# EAGLE design AR0130_DEV_BOARD_BREAKOUT_V2 (EAGLE 9.0.0)
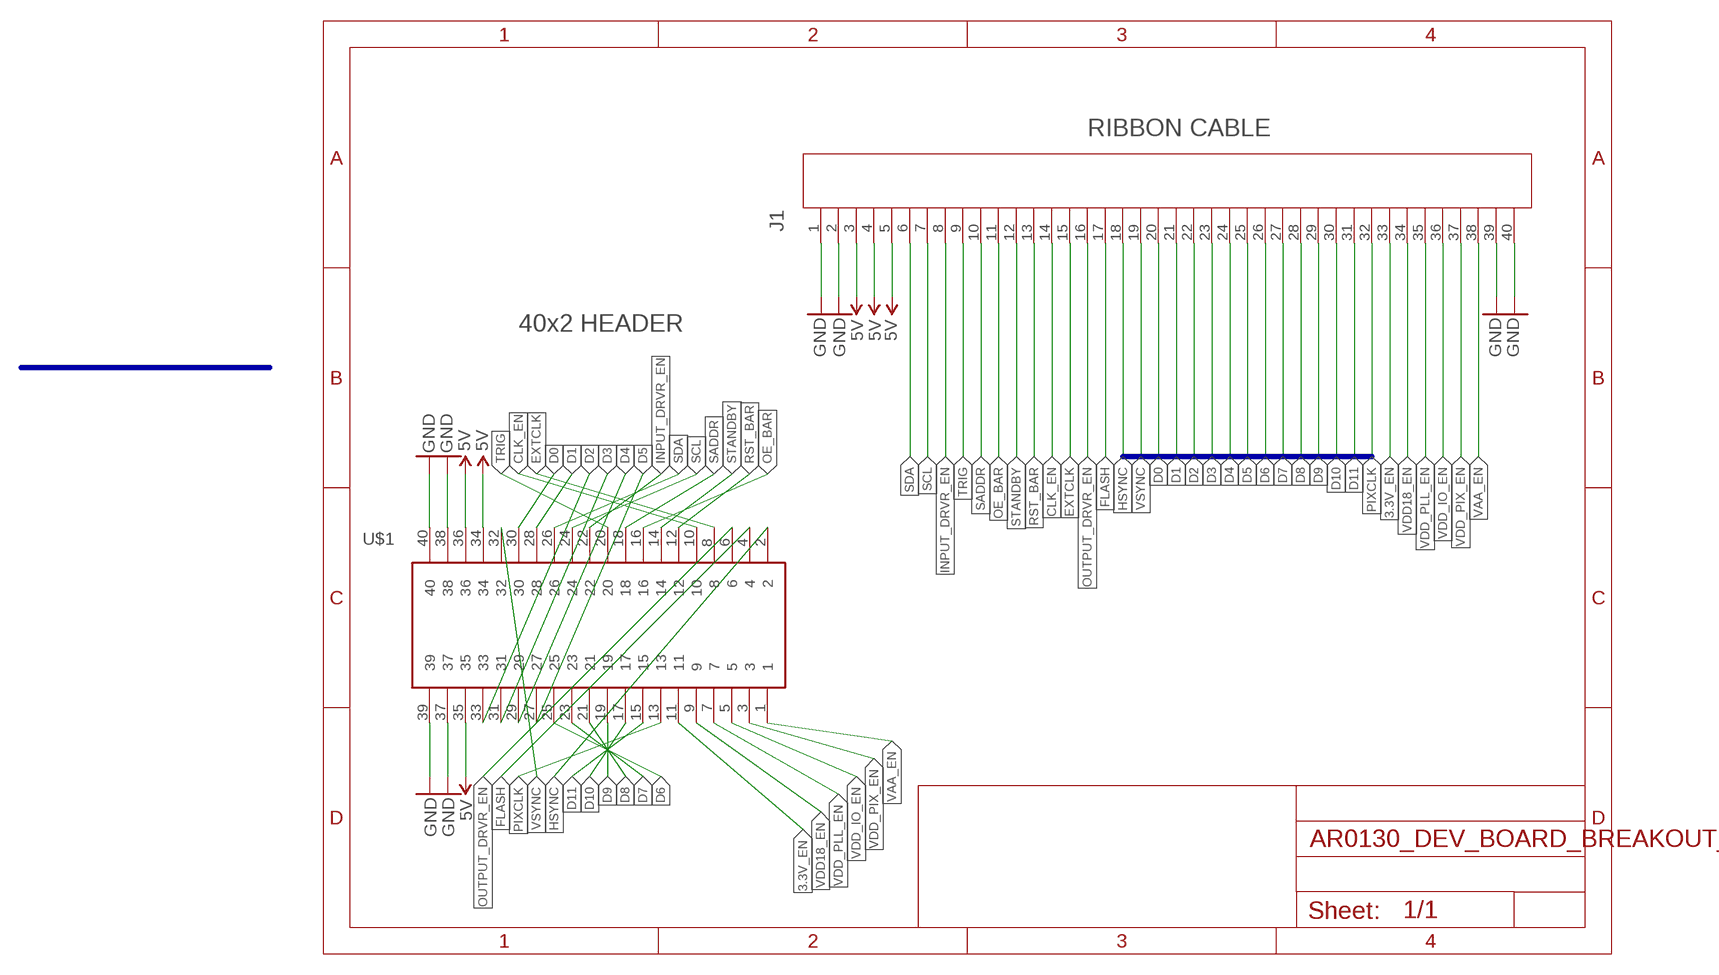
[diagram p0: schematic, sheet 1]

## Parts
J1  4-1734592-0  [CONN_4-1734592-0_TYCO]
U$1  HTSW-120-XX-XXX-D  [CON40_2X20_TU_TSW]

## Nets
3.3V_EN: J1.33 U$1.11
5V: J1.3 J1.4 J1.5 U$1.34 U$1.35 U$1.36
CLK_EN: J1.14 U$1.10
D0: J1.20 U$1.30
D1: J1.21 U$1.28
D2: J1.22 U$1.33
D3: J1.23 U$1.31
D4: J1.24 U$1.29
D5: J1.25 U$1.27
D6: J1.26 U$1.25
D7: J1.27 U$1.23
D8: J1.28 U$1.21
D9: J1.29 U$1.19
D10: J1.30 U$1.17
D11: J1.31 U$1.15
EXTCLK: J1.15 U$1.8
FLASH: J1.17 U$1.4
GND: J1.1 J1.2 J1.39 J1.40 U$1.37 U$1.38 U$1.39 U$1.40
HSYNC: J1.18 U$1.2
INPUT_DRVR_EN: J1.8 U$1.22
OE_BAR: J1.11 U$1.16
OUTPUT_DRVR_EN: J1.16 U$1.6
PIXCLK: J1.32 U$1.13
RST_BAR: J1.13 U$1.12
SADDR: J1.10 U$1.18
SCL: J1.7 U$1.24
SDA: J1.6 U$1.26
STANDBY: J1.12 U$1.14
TRIG: J1.9 U$1.20
VAA_EN: J1.38 U$1.1
VDD18_EN: J1.34 U$1.9
VDD_IO_EN: J1.36 U$1.5
VDD_PIX_EN: J1.37 U$1.3
VDD_PLL_EN: J1.35 U$1.7
VSYNC: J1.19 U$1.32

## Buses
D[0..11],HSYNC,VSYNC,PIXCLK

## Notes on the sheet
- RIBBON CABLE
- 40x2 HEADER

## Library data of the parts
J1 = Oliver_Custom:4-1734592-0; MANUFACTURER_PART_NUMBER: 417345920; VENDOR: TE Connectivity
U$1 = Oliver_Custom:HTSW-120-XX-XXX-D

## Board
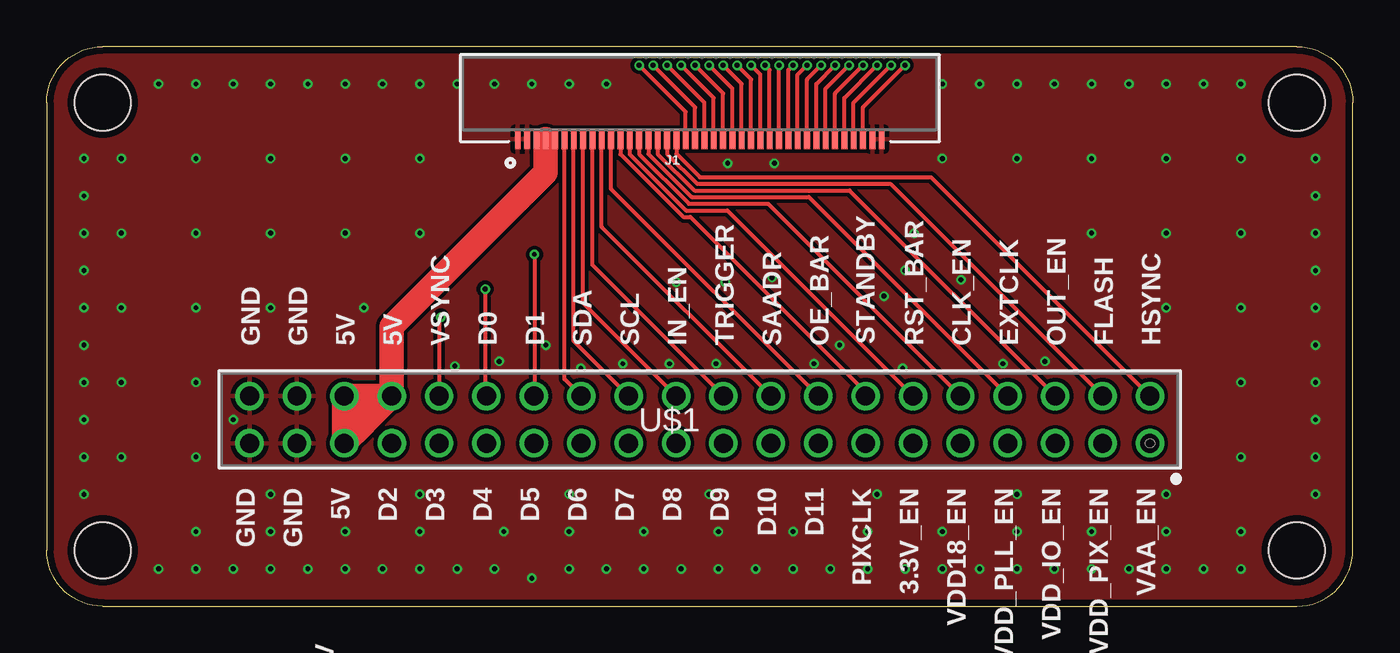
[diagram p1: board, top side]
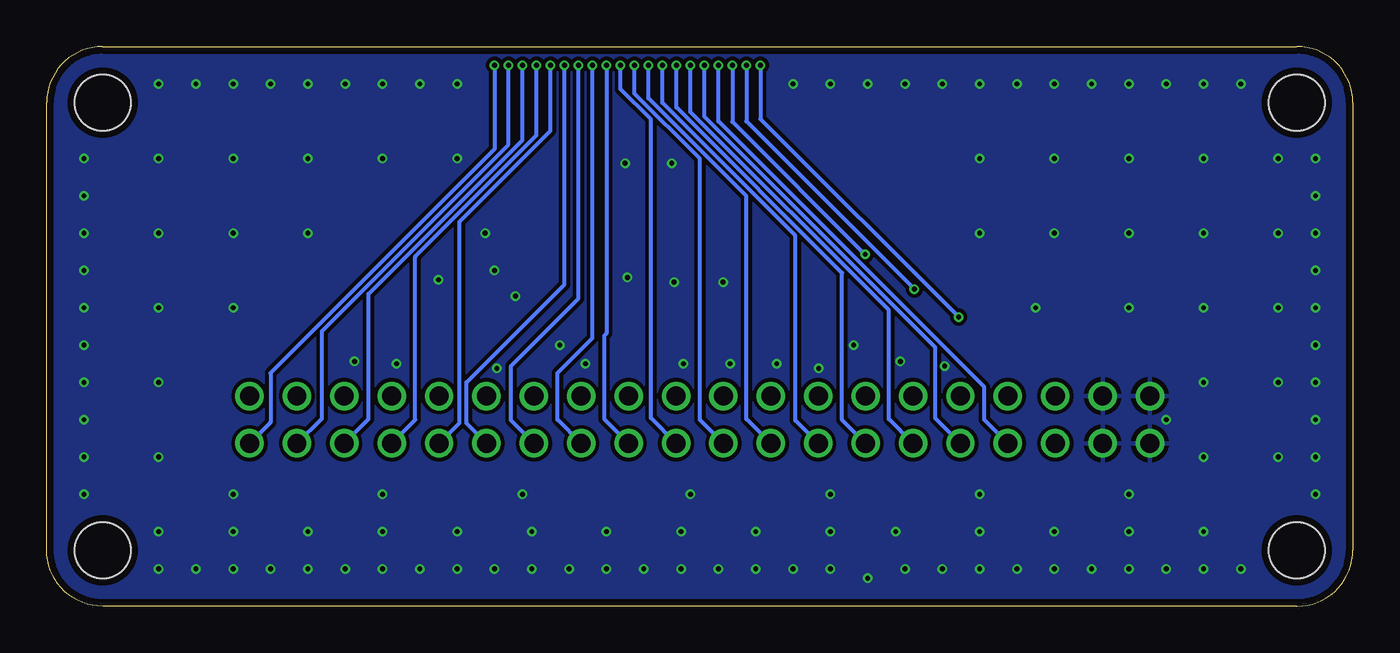
[diagram p2: board, bottom side, seen from below]

Size 70 x 30 mm. Coordinates in mm from the lower left corner, seen from the top.
Outline: 3,0 67,0 arc90 70,3 70,27 arc90 67,30 3,30 arc90 0,27 0,3 arc90 3,0
Copper layers (1*16): Top 0.035559375mm / dielectric 1.6mm / Bottom 0.035559375mm
Design rules "oshpark-2layer-tented": minimum track width 6mil, minimum drill 10mil, track to track 6mil, track to pad 6mil, pad to pad 6mil, via to via 6mil, smd to smd 6mil, copper to edge 15mil, drill to drill 6mil, minimum pad ring 5mil, minimum via ring 5mil, stop-mask expansion 2.5mil, vias tented up to drill 20mil, thermal gap 10mil
Holes 3 mm at 3,3 67,3 3,27 67,27

### Footprints (pad centres in the part's own frame; a part is rotated, then mirrored left to right if it is on the bottom)
CONN_4-1734592-0_TYCO = smd 0.305 x 1.092: 1 -9.751,0; 2 -9.251,0; 3 -8.751,0; 4 -8.251,0; 5 -7.75,0; 6 -7.25,0; 7 -6.75,0; 8 -6.25,0; 9 -5.751,0; 10 -5.25,0; 11 -4.75,0; 12 -4.25,0; 13 -3.751,0; 14 -3.251,0; 15 -2.751,0; 16 -2.251,0; 17 -1.75,0; 18 -1.25,0; 19 -0.751,0; 20 -0.251,0; 21 0.249,0; 22 0.75,0; 23 1.25,0; 24 1.749,0; 25 2.249,0; 26 2.749,0; 27 3.249,0; 28 3.749,0; 29 4.249,0; 30 4.75,0; 31 5.25,0; 32 5.749,0; 33 6.25,0; 34 6.749,0; 35 7.25,0; 36 7.75,0; 37 8.249,0; 38 8.749,0; 39 9.249,0; 40 9.749,0
CON40_2X20_TU_TSW = drill 1.016 pad 1.524: 1 24.13,-1.27; 2 24.13,1.27; 3 21.59,-1.27; 4 21.59,1.27; 5 19.05,-1.27; 6 19.05,1.27; 7 16.51,-1.27; 8 16.51,1.27; 9 13.97,-1.27; 10 13.97,1.27; 11 11.43,-1.27; 12 11.43,1.27; 13 8.89,-1.27; 14 8.89,1.27; 15 6.35,-1.27; 16 6.35,1.27; 17 3.81,-1.27; 18 3.81,1.27; 19 1.27,-1.27; 20 1.27,1.27; 21 -1.27,-1.27; 22 -1.27,1.27; 23 -3.81,-1.27; 24 -3.81,1.27; 25 -6.35,-1.27; 26 -6.35,1.27; 27 -8.89,-1.27; 28 -8.89,1.27; 29 -11.43,-1.27; 30 -11.43,1.27; 31 -13.97,-1.27; 32 -13.97,1.27; 33 -16.51,-1.27; 34 -16.51,1.27; 35 -19.05,-1.27; 36 -19.05,1.27; 37 -21.59,-1.27; 38 -21.59,1.27; 39 -24.13,-1.27; 40 -24.13,1.27

### Placement (x,y rotation side)
J1  35,25.04 0 top
U$1  35,10 0 top

### Tracks (layer width: path | path; a pad name or v marks a point on that pad's centre or on a via)
3.3V_EN  (via drill 0.25)
  Top 0.203: J1.33 41.25,28 v42.25,29
  Bottom 0.203: U$1.11 47.5,9.8 47.5,12 42.25,17.25 v42.25,29
5V
  Top 0.254: J1.3 J1.4 J1.5
  Top 1.3: U$1.35 U$1.36 17,11.27 | 17,11.27 U$1.34 | U$1.34 18.49,14.99 26.75,23.25 J1.4 | U$1.35 U$1.34 | U$1.35 17,9.78 17,11.27
CLK_EN
  Top 0.203: J1.14 31.75,24.24 34.41,21.58 38.66,21.58 U$1.10
D0  (via drill 0.25)
  Top 0.203: J1.20 34.75,26.75 v32.5,29 | v23.5,17 23.5,11.34 U$1.30
  Bottom 0.203: v32.5,29 32.5,26 v23.5,17
D1  (via drill 0.25)
  Top 0.203: J1.21 35.25,27 v33.25,29 | v26.14,18.86 26.14,11.3 U$1.28
  Bottom 0.203: v33.25,29 33.25,25.97 v26.14,18.86
D2  (via drill 0.25)
  Top 0.203: J1.22 35.75,27.25 v34,29
  Bottom 0.203: U$1.33 19.75,9.99 19.75,11.75 34,26 v34,29
D3  (via drill 0.25)
  Top 0.203: J1.23 36.25,27.5 v34.75,29
  Bottom 0.203: U$1.31 22.38,10.07 22.38,13.87 34.75,26.25 v34.75,29
D4  (via drill 0.25)
  Top 0.203: J1.24 36.75,27.75 v35.5,29
  Bottom 0.203: U$1.29 24.88,10.04 24.88,15.87 35.5,26.49 v35.5,29
D5  (via drill 0.25)
  Top 0.203: J1.25 37.25,28 v36.25,29
  Bottom 0.203: U$1.27 27.38,9.99 27.38,17.87 36.25,26.74 v36.25,29
D6  (via drill 0.25)
  Top 0.203: J1.26 37.75,28.25 v37,29
  Bottom 0.203: U$1.25 29.88,9.96 29.88,19.86 37,26.99 v37,29
D7  (via drill 0.25)
  Top 0.203: J1.27 38.25,28.5 v37.75,29
  Bottom 0.203: U$1.23 32.5,10.04 32.5,21.98 37.75,27.23 v37.75,29
D8  (via drill 0.25)
  Top 0.203: J1.28 38.75,28.75 v38.5,29
  Bottom 0.203: U$1.21 35,10 35,23.98 38.5,27.48 v38.5,29
D9  (via drill 0.25)
  Top 0.152: v39.25,29
  Top 0.203: J1.29 v39.25,29
  Bottom 0.203: U$1.19 37.62,10.09 37.62,26.11 39.25,27.73 v39.25,29
D10  (via drill 0.25)
  Top 0.203: J1.30 39.75,28.75 v40,29
  Bottom 0.203: U$1.17 40.12,10.04 40.12,14.5 40,14.62 v40,29
D11  (via drill 0.25)
  Top 0.203: J1.31 40.25,28.5 v40.75,29
  Bottom 0.203: U$1.15 42.62,10.01 42.62,12.5 40.75,14.38 v40.75,29
EXTCLK
  Top 0.203: U$1.8 40.85,21.93 34.56,21.93 32.25,24.24 J1.15
FLASH
  Top 0.203: U$1.4 45.22,22.64 34.85,22.64 33.25,24.25 J1.17
GND  (via drill 0.25)
  other vias: 10,10 6,2 8,2 10,2 12,2 14,2 16,2 18,2 20,2 22,2 24,2 26,1.5 28,2 30,2 32,2 34,2 36,2 38,2 40,2 42,2 44,2 46,2 48,2 50,2 52,2 54,2 56,2 58,2 60,2 62,2 64,2 68,6 68,8 68,10 68,12 68,14 68,16 68,18 68,20 68,22 2,6 2,8 2,10 2,12 2,14 2,16 2,18 2,20 2,22 2,24 6,28 8,28 10,28 12,28 14,28 16,28 18,28 20,28 22,28 24,28 26,28 28,28 30,28 48,28 50,28 52,28 54,28 56,28 58,28 60,28 62,28 64,28 8,24 12,24 16,24 20,24 20,20 16,20 12,20 8,20 8,16 12,16 17,16 4,16 4,20 4,24 4,12 8,12 8,8 4,8 8,4 12,4 16,4 20,4 24.5,4 28,4 32,4 36,4 40,4 44,4 48,4 52,4 56,4 60,4 64,4 64,8 64,12 64,16 60,16 60,20 64,20 64,24 60,24 68,24 56,24 56,20 52,24 48,24 12,6 20,6 28,6 35.5,6 44.5,6 52,6 60,6 46,18 46.5,20 49,17.5 33.75,17.38 36.38,17.38 39,23.75 36.5,23.75 44.88,16.62 42.5,14 41.12,13 45.88,12.75 35.88,13 33.38,13 38.88,17.62 51.25,13 53.5,13.12 30.88,13 28.62,12.75 26.75,14 24.25,13.12 21.88,12.88
  pour Top (isolate 0.2): 0,0 70,0 70,25.75 70,30 44.5,30 0,30
  pour Bottom (isolate 0.2): 0,0 70,0 70,25.75 70,30 44.5,30 0,30
HSYNC
  Top 0.203: J1.18 33.75,24.25 35,23 47.4,23 U$1.2
INPUT_DRVR_EN
  Top 0.203: U$1.22 28.75,16.25 J1.8
OE_BAR
  Top 0.203: U$1.16 30.25,22.37 J1.11
OUTPUT_DRVR_EN
  Top 0.203: U$1.6 43.03,22.29 34.7,22.29 32.75,24.25 J1.16
PIXCLK  (via drill 0.25)
  Top 0.203: J1.32 40.75,28.25 v41.5,29
  Bottom 0.203: U$1.13 45.12,9.96 45.12,12.88 41.5,16.5 v41.5,29
RST_BAR
  Top 0.203: J1.13 31.25,24.24 34.26,21.22 36.48,21.22 U$1.12
SADDR
  Top 0.203: U$1.18 29.75,20.33 J1.10
SCL
  Top 0.203: U$1.24 28.25,14.21 J1.7
SDA
  Top 0.203: U$1.26 27.75,12.17 J1.6
STANDBY
  Top 0.203: J1.12 30.75,24.23 34.12,20.87 34.5,20.87 43.89,11.48 U$1.14
TRIG
  Top 0.203: U$1.20 29.25,18.29 J1.9
VAA_EN  (via drill 0.25)
  Top 0.203: J1.38 43.75,26.75 v46,29
  Bottom 0.203: v46,29 46,24.5 58,12.5 58,9.86 U$1.1
VDD18_EN  (via drill 0.25)
  Top 0.203: J1.34 41.75,27.75 v43,29
  Bottom 0.203: v43,29 43,25.49 47.88,20.61 47.88,9.82 U$1.9
VDD_IO_EN  (via drill 0.25)
  Top 0.203: J1.36 42.75,27.25 v44.5,29
  Bottom 0.203: U$1.5 52.75,10.03 52.75,16.74 44.5,24.99 v44.5,29
VDD_PIX_EN  (via drill 0.25)
  Top 0.203: J1.37 43.25,27 v45.25,29
  Bottom 0.203: U$1.3 55.25,10.07 55.25,14.75 45.25,24.75 v45.25,29
VDD_PLL_EN  (via drill 0.25)
  Top 0.203: J1.35 42.25,27.5 v43.75,29
  Bottom 0.203: U$1.7 50.25,9.99 50.25,18.74 43.75,25.24 v43.75,29
VSYNC  (via drill 0.25)
  Top 0.203: J1.19 34.25,26.5 v31.75,29 | v21.12,15.5 21.03,15.4 U$1.32
  Bottom 0.203: v31.75,29 31.75,26.12 v21.12,15.5

### Text on the board
tPlace: GND | GND | 5V | 5V | VSYNC | D0 | D1 | SDA | SCL | IN_EN | TRIGGER | SAADR | OE_BAR | STANDBY | RST_BAR | CLK_EN | EXTCLK | OUT_EN | FLASH | HSYNC | GND | GND | 5V | D2 | D3 | D4 | D5 | D6 | D7 | D8 | D9 | D10 | D11 | PIXCLK | 3.3V_EN | VDD18_EN | VDD_PLL_EN | VDD_IO_EN | VDD_PIX_EN | VAA_EN | 5V